# EAGLE design Big-pixel-display-shield (EAGLE 6.2)
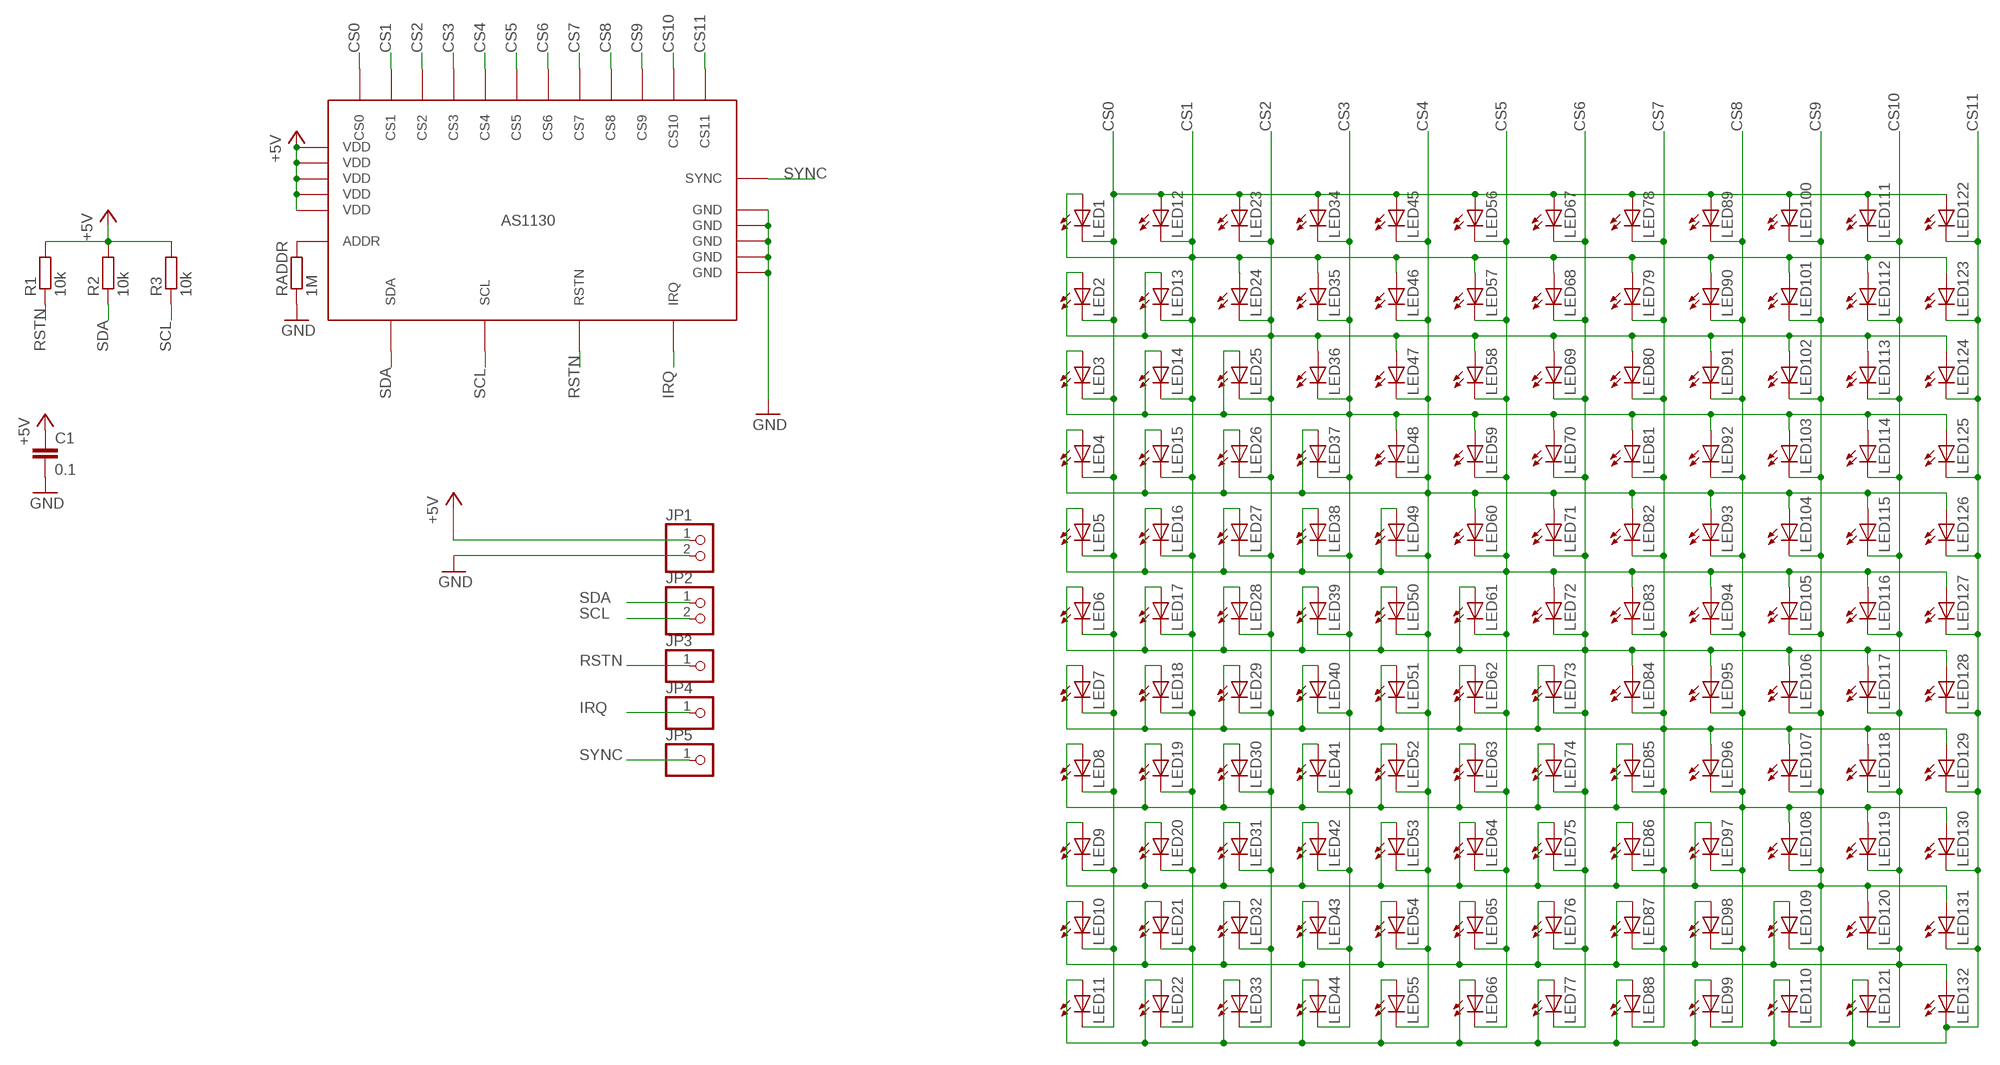
[diagram p0: schematic, sheet 1]

## Parts
C1  0.1  C-EUC0805  [C0805]
JP1  PINHD-1X2  [1X02]
JP2  PINHD-1X2  [1X02]
JP3  PINHD-1X1  [1X01]
JP4  PINHD-1X1  [1X01]
JP5  PINHD-1X1  [1X01]
LED1  LED5MM  [LED5MM]
LED2  LED5MM  [LED5MM]
LED3  LED5MM  [LED5MM]
LED4  LED5MM  [LED5MM]
LED5  LED5MM  [LED5MM]
LED6  LED5MM  [LED5MM]
LED7  LED5MM  [LED5MM]
LED8  LED5MM  [LED5MM]
LED9  LED5MM  [LED5MM]
LED10  LED5MM  [LED5MM]
LED11  LED5MM  [LED5MM]
LED12  LED5MM  [LED5MM]
LED13  LED5MM  [LED5MM]
LED14  LED5MM  [LED5MM]
LED15  LED5MM  [LED5MM]
LED16  LED5MM  [LED5MM]
LED17  LED5MM  [LED5MM]
LED18  LED5MM  [LED5MM]
LED19  LED5MM  [LED5MM]
LED20  LED5MM  [LED5MM]
LED21  LED5MM  [LED5MM]
LED22  LED5MM  [LED5MM]
LED23  LED5MM  [LED5MM]
LED24  LED5MM  [LED5MM]
LED25  LED5MM  [LED5MM]
LED26  LED5MM  [LED5MM]
LED27  LED5MM  [LED5MM]
LED28  LED5MM  [LED5MM]
LED29  LED5MM  [LED5MM]
LED30  LED5MM  [LED5MM]
LED31  LED5MM  [LED5MM]
LED32  LED5MM  [LED5MM]
LED33  LED5MM  [LED5MM]
LED34  LED5MM  [LED5MM]
LED35  LED5MM  [LED5MM]
LED36  LED5MM  [LED5MM]
LED37  LED5MM  [LED5MM]
LED38  LED5MM  [LED5MM]
LED39  LED5MM  [LED5MM]
LED40  LED5MM  [LED5MM]
LED41  LED5MM  [LED5MM]
LED42  LED5MM  [LED5MM]
LED43  LED5MM  [LED5MM]
LED44  LED5MM  [LED5MM]
LED45  LED5MM  [LED5MM]
LED46  LED5MM  [LED5MM]
LED47  LED5MM  [LED5MM]
LED48  LED5MM  [LED5MM]
LED49  LED5MM  [LED5MM]
LED50  LED5MM  [LED5MM]
LED51  LED5MM  [LED5MM]
LED52  LED5MM  [LED5MM]
LED53  LED5MM  [LED5MM]
LED54  LED5MM  [LED5MM]
LED55  LED5MM  [LED5MM]
LED56  LED5MM  [LED5MM]
LED57  LED5MM  [LED5MM]
LED58  LED5MM  [LED5MM]
LED59  LED5MM  [LED5MM]
LED60  LED5MM  [LED5MM]
LED61  LED5MM  [LED5MM]
LED62  LED5MM  [LED5MM]
LED63  LED5MM  [LED5MM]
LED64  LED5MM  [LED5MM]
LED65  LED5MM  [LED5MM]
LED66  LED5MM  [LED5MM]
LED67  LED5MM  [LED5MM]
LED68  LED5MM  [LED5MM]
LED69  LED5MM  [LED5MM]
LED70  LED5MM  [LED5MM]
LED71  LED5MM  [LED5MM]
LED72  LED5MM  [LED5MM]
LED73  LED5MM  [LED5MM]
LED74  LED5MM  [LED5MM]
LED75  LED5MM  [LED5MM]
LED76  LED5MM  [LED5MM]
LED77  LED5MM  [LED5MM]
LED78  LED5MM  [LED5MM]
LED79  LED5MM  [LED5MM]
LED80  LED5MM  [LED5MM]
LED81  LED5MM  [LED5MM]
LED82  LED5MM  [LED5MM]
LED83  LED5MM  [LED5MM]
LED84  LED5MM  [LED5MM]
LED85  LED5MM  [LED5MM]
LED86  LED5MM  [LED5MM]
LED87  LED5MM  [LED5MM]
LED88  LED5MM  [LED5MM]
LED89  LED5MM  [LED5MM]
LED90  LED5MM  [LED5MM]
LED91  LED5MM  [LED5MM]
LED92  LED5MM  [LED5MM]
LED93  LED5MM  [LED5MM]
LED94  LED5MM  [LED5MM]
LED95  LED5MM  [LED5MM]
LED96  LED5MM  [LED5MM]
LED97  LED5MM  [LED5MM]
LED98  LED5MM  [LED5MM]
LED99  LED5MM  [LED5MM]
LED100  LED5MM  [LED5MM]
LED101  LED5MM  [LED5MM]
LED102  LED5MM  [LED5MM]
LED103  LED5MM  [LED5MM]
LED104  LED5MM  [LED5MM]
LED105  LED5MM  [LED5MM]
LED106  LED5MM  [LED5MM]
LED107  LED5MM  [LED5MM]
LED108  LED5MM  [LED5MM]
LED109  LED5MM  [LED5MM]
LED110  LED5MM  [LED5MM]
LED111  LED5MM  [LED5MM]
LED112  LED5MM  [LED5MM]
LED113  LED5MM  [LED5MM]
LED114  LED5MM  [LED5MM]
LED115  LED5MM  [LED5MM]
LED116  LED5MM  [LED5MM]
LED117  LED5MM  [LED5MM]
LED118  LED5MM  [LED5MM]
LED119  LED5MM  [LED5MM]
LED120  LED5MM  [LED5MM]
LED121  LED5MM  [LED5MM]
LED122  LED5MM  [LED5MM]
LED123  LED5MM  [LED5MM]
LED124  LED5MM  [LED5MM]
LED125  LED5MM  [LED5MM]
LED126  LED5MM  [LED5MM]
LED127  LED5MM  [LED5MM]
LED128  LED5MM  [LED5MM]
LED129  LED5MM  [LED5MM]
LED130  LED5MM  [LED5MM]
LED131  LED5MM  [LED5MM]
LED132  LED5MM  [LED5MM]
R1  10k  R-EU_R1206  [R1206]
R2  10k  R-EU_R1206  [R1206]
R3  10k  R-EU_R1206  [R1206]
RADDR  1M  R-EU_R1206  [R1206]
U$1  AS1130  [SSOP28]

## Nets
+5V: C1.1 JP1.1 R1.2 R2.2 R3.2 U$1.3(VDD) U$1.10(VDD) U$1.18(VDD) U$1.19(VDD) U$1.26(VDD)
CS0: LED1.K(C) LED2.K(C) LED3.K(C) LED4.K(C) LED5.K(C) LED6.K(C) LED7.K(C) LED8.K(C) LED9.K(C) LED10.K(C) LED11.K(C) LED12.A LED23.A LED34.A LED45.A LED56.A LED67.A LED78.A LED89.A LED100.A LED111.A LED122.A U$1.25(CS0)
CS1: LED1.A LED12.K(C) LED13.K(C) LED14.K(C) LED15.K(C) LED16.K(C) LED17.K(C) LED18.K(C) LED19.K(C) LED20.K(C) LED21.K(C) LED22.K(C) LED24.A LED35.A LED46.A LED57.A LED68.A LED79.A LED90.A LED101.A LED112.A LED123.A U$1.27(CS1)
CS2: LED2.A LED13.A LED23.K(C) LED24.K(C) LED25.K(C) LED26.K(C) LED27.K(C) LED28.K(C) LED29.K(C) LED30.K(C) LED31.K(C) LED32.K(C) LED33.K(C) LED36.A LED47.A LED58.A LED69.A LED80.A LED91.A LED102.A LED113.A LED124.A U$1.23(CS2)
CS3: LED3.A LED14.A LED25.A LED34.K(C) LED35.K(C) LED36.K(C) LED37.K(C) LED38.K(C) LED39.K(C) LED40.K(C) LED41.K(C) LED42.K(C) LED43.K(C) LED44.K(C) LED48.A LED59.A LED70.A LED81.A LED92.A LED103.A LED114.A LED125.A U$1.24(CS3)
CS4: LED4.A LED15.A LED26.A LED37.A LED45.K(C) LED46.K(C) LED47.K(C) LED48.K(C) LED49.K(C) LED50.K(C) LED51.K(C) LED52.K(C) LED53.K(C) LED54.K(C) LED55.K(C) LED60.A LED71.A LED82.A LED93.A LED104.A LED115.A LED126.A U$1.21(CS4)
CS5: LED5.A LED16.A LED27.A LED38.A LED49.A LED56.K(C) LED57.K(C) LED58.K(C) LED59.K(C) LED60.K(C) LED61.K(C) LED62.K(C) LED63.K(C) LED64.K(C) LED65.K(C) LED66.K(C) LED72.A LED83.A LED94.A LED105.A LED116.A LED127.A U$1.20(CS5)
CS6: LED6.A LED17.A LED28.A LED39.A LED50.A LED61.A LED67.K(C) LED68.K(C) LED69.K(C) LED70.K(C) LED71.K(C) LED72.K(C) LED73.K(C) LED74.K(C) LED75.K(C) LED76.K(C) LED77.K(C) LED84.A LED95.A LED106.A LED117.A LED128.A U$1.2(CS6)
CS7: LED7.A LED18.A LED29.A LED40.A LED51.A LED62.A LED73.A LED78.K(C) LED79.K(C) LED80.K(C) LED81.K(C) LED82.K(C) LED83.K(C) LED84.K(C) LED85.K(C) LED86.K(C) LED87.K(C) LED88.K(C) LED96.A LED107.A LED118.A LED129.A U$1.4(CS7)
CS8: LED8.A LED19.A LED30.A LED41.A LED52.A LED63.A LED74.A LED85.A LED89.K(C) LED90.K(C) LED91.K(C) LED92.K(C) LED93.K(C) LED94.K(C) LED95.K(C) LED96.K(C) LED97.K(C) LED98.K(C) LED99.K(C) LED108.A LED119.A LED130.A U$1.5(CS8)
CS9: LED9.A LED20.A LED31.A LED42.A LED53.A LED64.A LED75.A LED86.A LED97.A LED100.K(C) LED101.K(C) LED102.K(C) LED103.K(C) LED104.K(C) LED105.K(C) LED106.K(C) LED107.K(C) LED108.K(C) LED109.K(C) LED110.K(C) LED120.A LED131.A U$1.6(CS9)
CS10: LED10.A LED21.A LED32.A LED43.A LED54.A LED65.A LED76.A LED87.A LED98.A LED109.A LED111.K(C) LED112.K(C) LED113.K(C) LED114.K(C) LED115.K(C) LED116.K(C) LED117.K(C) LED118.K(C) LED119.K(C) LED120.K(C) LED121.K(C) LED132.A U$1.9(CS10)
CS11: LED11.A LED22.A LED33.A LED44.A LED55.A LED66.A LED77.A LED88.A LED99.A LED110.A LED121.A LED122.K(C) LED123.K(C) LED124.K(C) LED125.K(C) LED126.K(C) LED127.K(C) LED128.K(C) LED129.K(C) LED130.K(C) LED131.K(C) LED132.K(C) U$1.8(CS11)
GND: C1.2 JP1.2 RADDR.1 U$1.1(GND) U$1.7(GND) U$1.14(GND) U$1.22(GND) U$1.28(GND)
IRQ: JP4.1 U$1.11(IRQ)
N$1: RADDR.2 U$1.17(ADDR)
RSTN: JP3.1 R1.1 U$1.13(RSTN)
SCL: JP2.2 R3.1 U$1.15(SCL)
SDA: JP2.1 R2.1 U$1.16(SDA)
SYNC: JP5.1 U$1.12(SYNC)

## Library data of the parts
C1 = rcl:C-EU: CAPACITOR, European symbol
JP1 JP2 = pinhead:PINHD-1X2: PIN HEADER
JP3-JP5 = pinhead:PINHD-1X1: PIN HEADER
LED1-LED132 = adafruit:LED: LED OSRAM: - CHIPLED LG R971, LG N971, LY N971, LG Q971, LY Q971, LO R971, LY R971 LH N974, LH R974 LS Q976, LO Q976, LY Q976 LO Q996 - Hyper CHIPLED LW Q18S LB Q993, LB Q99A, LB R99A - SideLED LS A670, LO A670, LY A670, LG A670, LP A670 LB A673, LV A673, LT A673, LW A673 LH A674 LY A675 LS A676, LA A676, LO A676, LY A676, LW A676 LS A679, LY A679, LG A679 - Hyper Micro SIDELED® LS Y876, LA Y876, LO Y876, LY Y876 LT Y87S - SmartLED LW L88C, LW L88S LB L89C, LB L89S, LG L890 LS L89K, LO L89K, LY L89K LS L896, LA L896, LO L896, LY L896 - TOPLED LS T670, LO T670, LY T670, LG T670, LP T670 LSG T670, LSP T670, LSY T670, LOP T670, LYG T670 LG T671, LOG T671, LSG T671 LB T673, LV T673, LT T673, LW T673 LH T674 LS T676, LA T676, LO T676, LY T676, LB T676, LH T676, LSB T676, LW T676 LB T67C, LV T67C, LT T67C, LS T67K, LO T67K, LY T67K, LW E67C LS E67B, LA E67B, LO E67B, LY E67B, LB E67C, LV E67C, LT E67C LW T67C LS T679, LY T679, LG T679 LS T770, LO T770, LY T770, LG T770, LP T770 LB T773, LV T773, LT T773, LW T773 LH T774 LS E675, LA E675, LY E675, LS T675 LS T776, LA T776, LO T776, LY T776, LB T776 LHGB T686 LT T68C, LB T68C - Hyper Mini TOPLED® LB M676 - Mini TOPLED Santana® LG M470 LS M47K, LO M47K, LY M47K Source: http://www.osram.convergy.de/
R1-R3 RADDR = rcl:R-EU_: RESISTOR, European symbol
U$1 = smok:AS1130: LED driver for 132 single LEDs

## Board
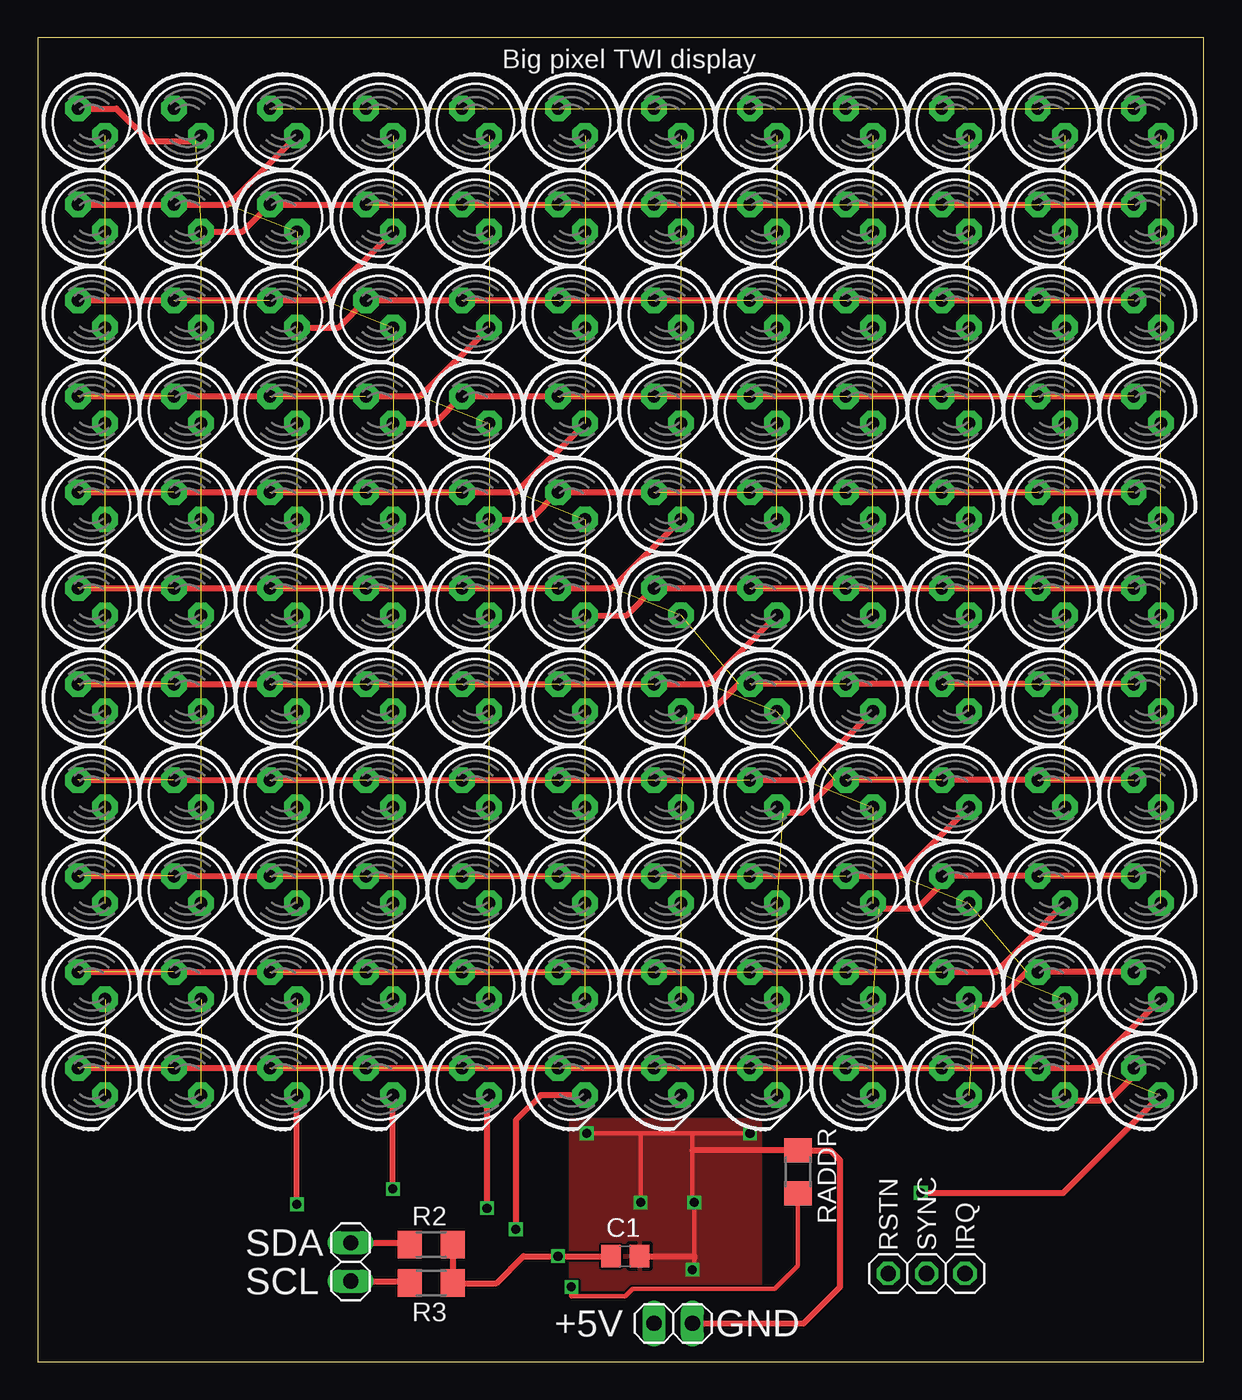
[diagram p1: board, top side]
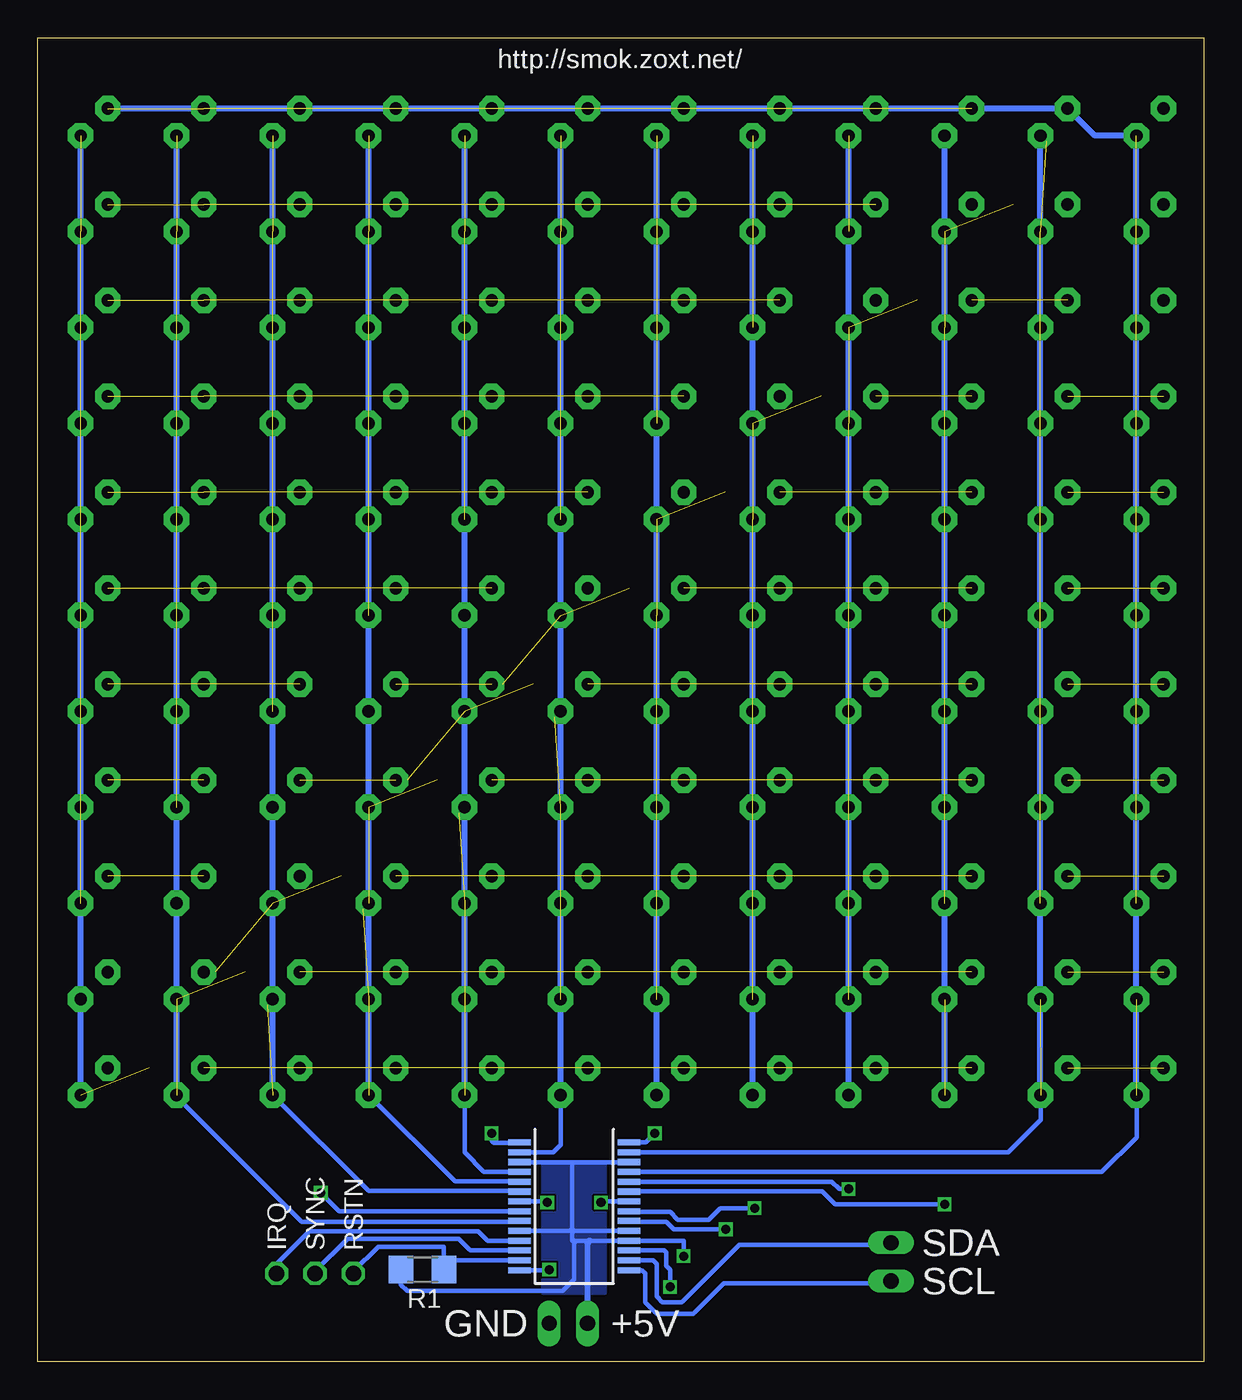
[diagram p2: board, bottom side, seen from below]

Size 77.14 x 87.62 mm. Coordinates in mm from the lower left corner, seen from the top.
Outline: 0,0 77.14,0 77.14,87.62 0,87.62 0,0
Copper layers (1*16): Top 0.035mm / dielectric 1.5mm / Bottom 0.035mm
Design rules: minimum track width 6mil, minimum drill 12mil, track to track 6mil, track to pad 6mil, pad to pad 6mil, via to via 6mil, smd to smd 0mil, copper to edge 10mil, drill to drill 10mil, minimum pad ring 10mil, minimum via ring 6mil, stop-mask expansion 2mil, vias tented up to drill 100mil, thermal gap 10mil

### Footprints (pad centres in the part's own frame; a part is rotated, then mirrored left to right if it is on the bottom)
C0805 = smd 1.3 x 1.5: 1 -0.95,0; 2 0.95,0
1X02 = drill 1.016 long: 1 -1.27,0; 2 1.27,0
1X01 = drill 1.016 octagon: 1 0,0
LED5MM = drill 0.813 pad 1.676 octagon: A -1.27,0; K 1.27,0
R1206 = smd 1.6 x 1.803: 1 -1.422,0; 2 1.422,0
SSOP28 = smd 0.4 x 1.5: 1 -4.225,-3.625; 2 -3.575,-3.625; 3 -2.925,-3.625; 4 -2.275,-3.625; 5 -1.625,-3.625; 6 -0.975,-3.625; 7 -0.325,-3.625; 8 0.325,-3.625; 9 0.975,-3.625; 10 1.625,-3.625; 11 2.275,-3.625; 12 2.925,-3.625; 13 3.575,-3.625; 14 4.225,-3.625; 15 4.225,3.625; 16 3.575,3.625; 17 2.925,3.625; 18 2.275,3.625; 19 1.625,3.625; 20 0.975,3.625; 21 0.325,3.625; 22 -0.325,3.625; 23 -0.975,3.625; 24 -1.625,3.625; 25 -2.275,3.625; 26 -2.925,3.625; 27 -3.575,3.625; 28 -4.225,3.625

### Placement (x,y rotation side)
C1  38.86,6.99 0 top
JP1  42.04,2.54 0 top
JP2  20.7,6.6 270 top
JP3  56.26,5.84 0 top
JP4  61.34,5.84 0 top
JP5  58.8,5.84 0 top
LED1  3.56,82.04 315 top
LED2  3.56,75.69 315 top
LED3  3.56,69.34 315 top
LED4  3.56,62.99 315 top
LED5  3.56,56.64 315 top
LED6  3.56,50.29 315 top
LED7  3.56,43.94 315 top
LED8  3.56,37.59 315 top
LED9  3.56,31.24 315 top
LED10  3.56,24.89 315 top
LED11  3.56,18.54 315 top
LED12  9.91,82.04 315 top
LED13  9.91,75.69 315 top
LED14  9.91,69.34 315 top
LED15  9.91,62.99 315 top
LED16  9.91,56.64 315 top
LED17  9.91,50.29 315 top
LED18  9.91,43.94 315 top
LED19  9.91,37.59 315 top
LED20  9.91,31.24 315 top
LED21  9.91,24.89 315 top
LED22  9.91,18.54 315 top
LED23  16.26,82.04 315 top
LED24  16.26,75.69 315 top
LED25  16.26,69.34 315 top
LED26  16.26,62.99 315 top
LED27  16.26,56.64 315 top
LED28  16.26,50.29 315 top
LED29  16.26,43.94 315 top
LED30  16.26,37.59 315 top
LED31  16.26,31.24 315 top
LED32  16.26,24.89 315 top
LED33  16.26,18.54 315 top
LED34  22.61,82.04 315 top
LED35  22.61,75.69 315 top
LED36  22.61,69.34 315 top
LED37  22.61,62.99 315 top
LED38  22.61,56.64 315 top
LED39  22.61,50.29 315 top
LED40  22.61,43.94 315 top
LED41  22.61,37.59 315 top
LED42  22.61,31.24 315 top
LED43  22.61,24.89 315 top
LED44  22.61,18.54 315 top
LED45  28.96,82.04 315 top
LED46  28.96,75.69 315 top
LED47  28.96,69.34 315 top
LED48  28.96,62.99 315 top
LED49  28.96,56.64 315 top
LED50  28.96,50.29 315 top
LED51  28.96,43.94 315 top
LED52  28.96,37.59 315 top
LED53  28.96,31.24 315 top
LED54  28.96,24.89 315 top
LED55  28.96,18.54 315 top
LED56  35.31,82.04 315 top
LED57  35.31,75.69 315 top
LED58  35.31,69.34 315 top
LED59  35.31,62.99 315 top
LED60  35.31,56.64 315 top
LED61  35.31,50.29 315 top
LED62  35.31,43.94 315 top
LED63  35.31,37.59 315 top
LED64  35.31,31.24 315 top
LED65  35.31,24.89 315 top
LED66  35.31,18.54 315 top
LED67  41.66,82.04 315 top
LED68  41.66,75.69 315 top
LED69  41.66,69.34 315 top
LED70  41.66,62.99 315 top
LED71  41.66,56.64 315 top
LED72  41.66,50.29 315 top
LED73  41.66,43.94 315 top
LED74  41.66,37.59 315 top
LED75  41.66,31.24 315 top
LED76  41.66,24.89 315 top
LED77  41.66,18.54 315 top
LED78  48.01,82.04 315 top
LED79  48.01,75.69 315 top
LED80  48.01,69.34 315 top
LED81  48.01,62.99 315 top
LED82  48.01,56.64 315 top
LED83  48.01,50.29 315 top
LED84  48.01,43.94 315 top
LED85  48.01,37.59 315 top
LED86  48.01,31.24 315 top
LED87  48.01,24.89 315 top
LED88  48.01,18.54 315 top
LED89  54.36,82.04 315 top
LED90  54.36,75.69 315 top
LED91  54.36,69.34 315 top
LED92  54.36,62.99 315 top
LED93  54.36,56.64 315 top
LED94  54.36,50.29 315 top
LED95  54.36,43.94 315 top
LED96  54.36,37.59 315 top
LED97  54.36,31.24 315 top
LED98  54.36,24.89 315 top
LED99  54.36,18.54 315 top
LED100  60.71,82.04 315 top
LED101  60.71,75.69 315 top
LED102  60.71,69.34 315 top
LED103  60.71,62.99 315 top
LED104  60.71,56.64 315 top
LED105  60.71,50.29 315 top
LED106  60.71,43.94 315 top
LED107  60.71,37.59 315 top
LED108  60.71,31.24 315 top
LED109  60.71,24.89 315 top
LED110  60.71,18.54 315 top
LED111  67.06,82.04 315 top
LED112  67.06,75.69 315 top
LED113  67.06,69.34 315 top
LED114  67.06,62.99 315 top
LED115  67.06,56.64 315 top
LED116  67.06,50.29 315 top
LED117  67.06,43.94 315 top
LED118  67.06,37.59 315 top
LED119  67.06,31.24 315 top
LED120  67.06,24.89 315 top
LED121  67.06,18.54 315 top
LED122  73.41,82.04 315 top
LED123  73.41,75.69 315 top
LED124  73.41,69.34 315 top
LED125  73.41,62.99 315 top
LED126  73.41,56.64 315 top
LED127  73.41,50.29 315 top
LED128  73.41,43.94 315 top
LED129  73.41,37.59 315 top
LED130  73.41,31.24 315 top
LED131  73.41,24.89 315 top
LED132  73.41,18.54 315 top
R1  51.69,6.1 180 bottom
R2  26.04,7.75 0 top
R3  26.04,5.21 0 top
RADDR  50.29,12.57 270 top
U$1  41.66,10.29 270 bottom

### Tracks (layer width: path | path; a pad name or v marks a point on that pad's centre or on a via)
+5V  (via drill 0.6)
  Top 0.406: C1.1 v34.42,6.99 32.13,6.99 30.35,5.21 R3.2 R2.2
  Bottom 0.305: U$1.26 U$1.3 41.79,13.21 41.78,13.21 41.78,8.79 | U$1.10 41.91,8.66 | 41.91,8.66 U$1.19 | 41.78,8.79 41.91,8.66 | 41.53,8.01 40.64,8.01 U$1.18 34.42,8.01 v34.42,6.99 | 41.53,8.01 41.78,8.01 41.78,8.79 | R1.2 53.11,5.11 52.7,4.7 42.42,4.7 41.66,5.46 41.66,7.88 41.53,8.01
  Bottom 0.406: JP1.1 40.77,7.88 40.64,8.01
  pour Bottom: 39.62,4.57 39.62,13.21 43.69,13.21 43.69,4.57
CS0  (18 unrouted)
  Bottom 0.305: U$1.25 6.74,12.56 4.45,14.86 LED11.K
  Bottom 0.406: LED11.K LED1.K 7.21,81.14 LED12.A LED122.A
CS1  (17 unrouted)
  Top 0.406: LED1.A 5.2,82.94 7.37,80.77 10.43,80.77 LED12.K | LED13.K 13.56,74.79 LED24.A LED123.A
  Bottom 0.305: U$1.27 12.94,13.86 10.79,16 LED22.K
  Bottom 0.406: LED22.K LED12.K
CS2  (via drill 0.6)  (16 unrouted)
  Top 0.406: LED25.K 19.91,68.44 LED36.A LED124.A | LED2.A LED13.A 12.6,76.59 LED23.K | v17.14,10.41 LED33.K
  Bottom 0.305: U$1.23 25.23,11.26 24.38,10.41 v17.14,10.41
  Bottom 0.406: LED33.K LED23.K
CS3  (via drill 0.6)  (16 unrouted)
  Top 0.406: LED3.A LED25.A 18.95,70.24 LED35.K | LED37.K 26.26,62.09 LED48.A LED125.A | v23.5,11.43 LED44.K
  Bottom 0.305: U$1.24 24.61,11.91 24.13,11.43 v23.5,11.43
  Bottom 0.406: LED44.K LED34.K
CS4  (via drill 0.6)  (16 unrouted)
  Top 0.406: LED4.A LED37.A 25.3,63.89 LED47.K | LED49.K 32.61,55.74 LED60.A LED126.A | LED55.K 29.72,17.64 v29.72,10.16
  Bottom 0.305: U$1.21 38.03,9.91 35.31,9.91 34.8,9.4 32.77,9.4 32,10.16 v29.72,10.16
  Bottom 0.406: LED55.K LED45.K
CS5  (via drill 0.6)  (16 unrouted)
  Top 0.406: LED5.A LED49.A 31.65,57.54 LED59.K | LED61.K 38.96,49.39 LED72.A LED127.A | LED66.K 33.27,17.64 31.62,16 v31.62,8.76
  Bottom 0.305: v31.62,8.76 35.05,8.76 35.56,9.27 37.99,9.27 U$1.20
  Bottom 0.406: LED66.K LED56.K
CS6  (16 unrouted)
  Top 0.406: LED6.A LED61.A 38,51.19 LED71.K | LED128.A LED84.A 46.36,44.84 44.2,42.67 42.93,42.67 LED73.K
  Bottom 0.305: LED77.K 42.55,14.34 43.05,13.84 45.26,13.84 U$1.2
  Bottom 0.406: LED77.K LED67.K
CS7  (16 unrouted)
  Top 0.406: LED7.A LED73.A 44.35,44.84 LED83.K | LED129.A LED96.A 52.71,38.49 50.55,36.32 49.28,36.32 LED85.K
  Bottom 0.305: LED88.K 48.9,13.85 47.62,12.57 45.29,12.57 U$1.4
  Bottom 0.406: LED88.K LED78.K
CS8  (16 unrouted)
  Top 0.406: LED8.A LED85.A 50.7,38.49 LED95.K | LED130.A LED108.A 59.81,31.61 58.17,29.97 55.63,29.97 LED97.K
  Bottom 0.305: LED99.K 55.24,17.64 49.53,11.94 45.31,11.94 U$1.5
  Bottom 0.406: LED99.K LED89.K
CS9  (16 unrouted)
  Top 0.406: LED9.A LED97.A 57.05,32.14 LED107.K | LED131.A LED120.A 65.41,25.79 63.25,23.62 61.98,23.62 LED109.K
  Bottom 0.305: U$1.6 45.32,11.3 55.24,11.3 61.59,17.64 LED110.K
  Bottom 0.406: LED110.K LED100.K
CS10  (17 unrouted)
  Top 0.406: LED10.A LED109.A 63.4,25.79 LED119.K | LED132.A 72.51,18.91 70.87,17.27 68.33,17.27 LED121.K
  Bottom 0.305: LED121.K 68.07,17.53 67.94,17.53 59.69,9.27 45.32,9.27 U$1.9
  Bottom 0.406: LED121.K LED111.K
CS11  (via drill 0.6)  (18 unrouted)
  Top 0.406: LED11.A LED121.A 69.75,19.44 LED131.K | v58.42,11.18 67.84,11.18 LED132.K
  Bottom 0.305: U$1.8 57.21,9.96 v58.42,11.18
  Bottom 0.406: LED132.K LED122.K
GND  (via drill 0.6)
  Top 0.305: v36.32,15.11 39.88,15.11 | 39.88,15.11 43.31,15.11 | 43.31,15.11 v47.12,15.11 | v39.88,10.54 39.88,15.11 | 43.31,15.11 43.31,13.97 43.31,10.54 v43.43,10.54 43.43,6.86 43.43,6.1 v43.31,6.1
  Top 0.406: C1.2 43.43,6.99 43.43,6.86 | 43.31,13.97 43.31,14 RADDR.1 50.32,13.97 52.45,13.97 53.09,13.34 53.09,4.95 50.67,2.54 JP1.2
  Bottom 0.305: U$1.28 36.92,14.51 v36.32,15.11 | v47.12,15.11 47.12,14.61 46.99,14.48 45.31,14.48 U$1.1 | U$1.22 39.88,10.61 v39.88,10.54 | U$1.7 43.43,10.61 v43.43,10.54 | U$1.14 43.31,6.06 v43.31,6.1
  pour Top: 35.31,16 47.75,16 47.75,4.83 35.31,4.83
IRQ
  Bottom 0.305: JP4.1 61.34,6.48 59.18,8.64 48.01,8.64 47.38,8.01 U$1.11
N$1  (via drill 0.6)
  Top 0.305: v35.31,4.95 35.31,4.32 38.86,4.32 39.37,4.83 48.77,4.83 50.29,6.35 RADDR.2
  Top 0.406: RADDR.2 50.29,11.05
  Bottom 0.305: v35.31,4.95 35.31,6.1 35.56,6.35 35.56,7.24 35.69,7.37 U$1.17
RSTN
  Bottom 0.305: U$1.13 50.25,6.71 | 50.25,6.71 R1.1 | JP3.1 56.26,5.97 54.61,7.62 50.29,7.62 50.29,6.76 50.25,6.71
SCL
  Top 0.406: JP2.2 24.49,5.33 R3.1
  Bottom 0.305: U$1.15 37.18,6.06 36.96,5.84 36.96,3.94 36.2,3.17 33.78,3.17 31.75,5.21 20.83,5.21 JP2.2
SDA
  Top 0.406: JP2.1 24.49,7.87 R2.1
  Bottom 0.305: U$1.16 36.43,6.71 36.2,6.48 36.2,4.32 35.81,3.94 34.54,3.94 30.73,7.75 20.83,7.75 JP2.1
SYNC
  Bottom 0.305: JP5.1 58.8,5.97 56.64,8.13 49.28,8.13 48.51,7.37 U$1.12

### Text on the board
_tsilk: Big pixel TWI display | RSTN | SYNC | IRQ | SDA | SCL | +5V | GND
_bsilk: http://smok.zoxt.net/ | RSTN | SYNC | IRQ | SDA | SCL | +5V | GND